# Altium project BTL_IoT.PrjPcb
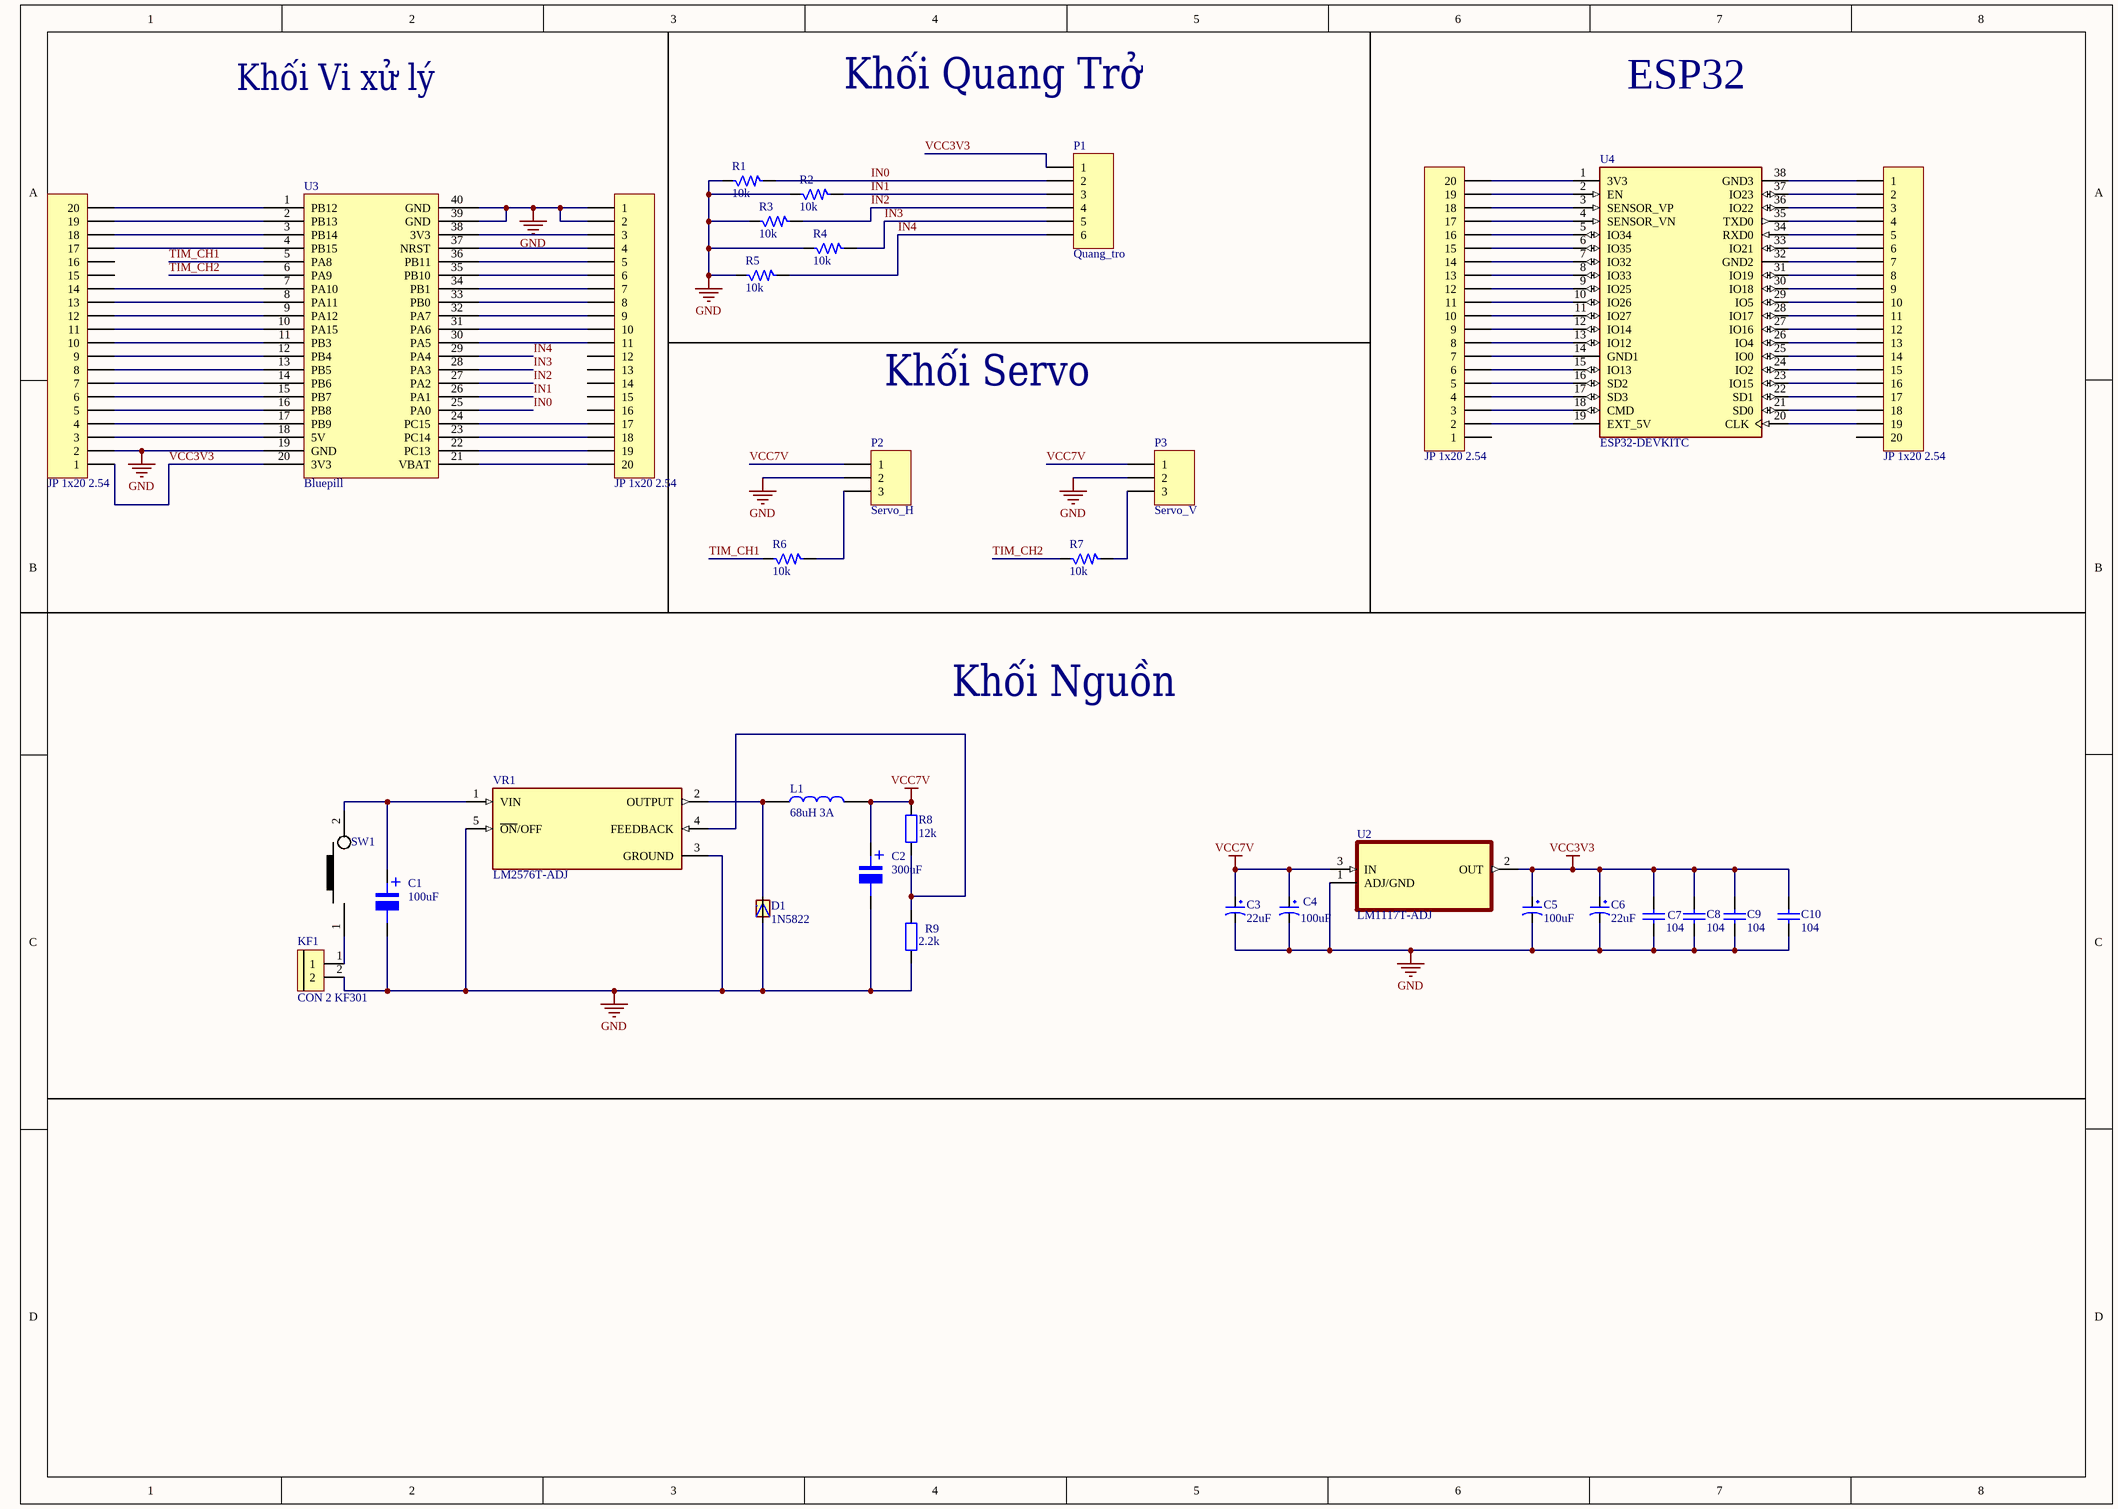
[diagram p0: BTL_IOT_STM32.SchDoc]
1 sheet, 34 parts. Net scope: global (net labels, ports and power ports of the same name join across sheets).
Board file: PCB3.PcbDoc

## Sheet BTL_IOT_STM32.SchDoc
size A3

### Parts
C1  100uF  [CA-ALU-5R]
C2  300uF  [CA-ALU-5R]
C3  22uF  [CA-ALU-5R]
C4  100uF  [CA-ALU-5R]
C5  100uF  [CA-ALU-5R]
C6  22uF  [CA-ALU-5R]
C7  104  [CN1]
C8  104  [CN1]
C9  104  [CN1]
C10  104  [CN1]
D1  1N5822  [DIOAD2120W130L950D530P]
JP1  JP 1x20 2.54  [JP 1x20 CC]
JP2  JP 1x20 2.54  [JP 1x20 CC]
JP3  JP 1x20 2.54  [JP 1x20 CC]
JP4  JP 1x20 2.54  [JP 1x20 CC]
KF1  CON 2 KF301  [Con 2 KF301 5.08]
L1  68uH 3A  [CUON CAM 100uH3A]
P1  Quang_tro  [HDR1X6]
P2  Servo_H  [HDR1X3]
P3  Servo_V  [HDR1X3]
R1  10k  [R1/8W]
R2  10k  [R1/8W]
R3  10k  [R1/8W]
R4  10k  [R1/8W]
R5  10k  [R1/8W]
R6  10k  [R1/8W]
R7  10k  [R1/8W]
R8  12k  [tro vach 1/4w]
R9  2.2k  [tro vach 1/4w]
SW1  SWITCH 10A-2PIN  [SW_2ARS_TH]  (value not drawn)
U2  LM1117T-ADJ  [TO254P470X1016X2222-3P]
U3  Bluepill  [Blue Pill]
U4  ESP32-DEVKITC  [MODULE_ESP32-DEVKITC]
VR1  LM2576T-ADJ  [TO170P1067X483X1651-5]

### Nets
GND: C1.2 C2.2 C3.2 C4.2 C5.2 C6.2 C7.2 C8.2 C9.2 C10.2 D1.A JP3.2 JP4.1 JP4.2 KF1.2 P2.2 P3.2 R1.1 R2.1 R3.1 R4.1 R5.1 R9.1 U2.1(ADJ/GND) U3.19(GND) U3.39(GND) U3.40(GND) VR1.3(GROUND) VR1.5(~{ON}/OFF)
VCC3V3: C5.1 C6.1 C7.1 C8.1 C9.1 C10.1 JP3.1 P1.1 U2.2(OUT) U3.20(3V3)
VCC7V: C2.1 C3.1 C4.1 L1.2 P2.1 P3.1 R8.2 U2.3(IN)
IN0: P1.2 R1.2 U3.25(PA0)
IN1: P1.3 R2.2 U3.26(PA1)
IN2: P1.4 R3.2 U3.27(PA2)
IN3: P1.5 R4.2 U3.28(PA3)
IN4: P1.6 R5.2 U3.29(PA4)
TIM_CH1: R6.1 U3.5(PA8)
TIM_CH2: R7.1 U3.6(PA9)
NetC1_1: C1.1 SW1.2 VR1.1(VIN)
NetD1_C: D1.C L1.1 VR1.2(OUTPUT)
NetJP1_2: JP1.2 U4.19(EXT_5V)
NetJP1_3: JP1.3 U4.18(CMD)
NetJP1_4: JP1.4 U4.17(SD3)
NetJP1_5: JP1.5 U4.16(SD2)
NetJP1_6: JP1.6 U4.15(IO13)
NetJP1_7: JP1.7 U4.14(GND1)
NetJP1_8: JP1.8 U4.13(IO12)
NetJP1_9: JP1.9 U4.12(IO14)
NetJP1_10: JP1.10 U4.11(IO27)
NetJP1_11: JP1.11 U4.10(IO26)
NetJP1_12: JP1.12 U4.9(IO25)
NetJP1_13: JP1.13 U4.8(IO33)
NetJP1_14: JP1.14 U4.7(IO32)
NetJP1_15: JP1.15 U4.6(IO35)
NetJP1_16: JP1.16 U4.5(IO34)
NetJP1_17: JP1.17 U4.4(SENSOR_VN)
NetJP1_18: JP1.18 U4.3(SENSOR_VP)
NetJP1_19: JP1.19 U4.2(EN)
NetJP1_20: JP1.20 U4.1(3V3)
NetJP2_1: JP2.1 U4.38(GND3)
NetJP2_2: JP2.2 U4.37(IO23)
NetJP2_3: JP2.3 U4.36(IO22)
NetJP2_4: JP2.4 U4.35(TXD0)
NetJP2_5: JP2.5 U4.34(RXD0)
NetJP2_6: JP2.6 U4.33(IO21)
NetJP2_7: JP2.7 U4.32(GND2)
NetJP2_8: JP2.8 U4.31(IO19)
NetJP2_9: JP2.9 U4.30(IO18)
NetJP2_10: JP2.10 U4.29(IO5)
NetJP2_11: JP2.11 U4.28(IO17)
NetJP2_12: JP2.12 U4.27(IO16)
NetJP2_13: JP2.13 U4.26(IO4)
NetJP2_14: JP2.14 U4.25(IO0)
NetJP2_15: JP2.15 U4.24(IO2)
NetJP2_16: JP2.16 U4.23(IO15)
NetJP2_17: JP2.17 U4.22(SD1)
NetJP2_18: JP2.18 U4.21(SD0)
NetJP2_19: JP2.19 U4.20(CLK)
NetJP3_3: JP3.3 U3.18(5V)
NetJP3_4: JP3.4 U3.17(PB9)
NetJP3_5: JP3.5 U3.16(PB8)
NetJP3_6: JP3.6 U3.15(PB7)
NetJP3_7: JP3.7 U3.14(PB6)
NetJP3_8: JP3.8 U3.13(PB5)
NetJP3_9: JP3.9 U3.12(PB4)
NetJP3_10: JP3.10 U3.11(PB3)
NetJP3_11: JP3.11 U3.10(PA15)
NetJP3_12: JP3.12 U3.9(PA12)
NetJP3_13: JP3.13 U3.8(PA11)
NetJP3_14: JP3.14 U3.7(PA10)
NetJP3_17: JP3.17 U3.4(PB15)
NetJP3_18: JP3.18 U3.3(PB14)
NetJP3_19: JP3.19 U3.2(PB13)
NetJP3_20: JP3.20 U3.1(PB12)
NetJP4_3: JP4.3 U3.38(3V3)
NetJP4_4: JP4.4 U3.37(NRST)
NetJP4_5: JP4.5 U3.36(PB11)
NetJP4_6: JP4.6 U3.35(PB10)
NetJP4_7: JP4.7 U3.34(PB1)
NetJP4_8: JP4.8 U3.33(PB0)
NetJP4_9: JP4.9 U3.32(PA7)
NetJP4_10: JP4.10 U3.31(PA6)
NetJP4_11: JP4.11 U3.30(PA5)
NetJP4_17: JP4.17 U3.24(PC15)
NetJP4_18: JP4.18 U3.23(PC14)
NetJP4_19: JP4.19 U3.22(PC13)
NetJP4_20: JP4.20 U3.21(VBAT)
NetKF1_1: KF1.1 SW1.1
NetP2_3: P2.3 R6.2
NetP3_3: P3.3 R7.2
NetR8_1: R8.1 R9.2 VR1.4(FEEDBACK)

Not connected (* = marked no-connect by the designer): JP1 1; JP2 20; JP3 15 16; JP4 12 13 14 15 16

### Notes on the sheet
- Khối Vi xử lý
- Khối Quang Trở
- ESP32
- Khối Servo
- Khối Nguồn
- (in symbol Tu Nhom 100uF 16V) +

### Library data of the parts
C1 C2 = Tu Nhom 100uF 16V: Dán; Don_Vi: Con; So_Chan: 2; Ten_Linh_Kien: Tụ Nhôm 100uF 16V 6.3x5.4MM; Ma_Hang: MH002219; Chung_Loai: Dán; Kieu_Chan: *
C3 C6 = Tu tantalum 22uF 25V SMD6032: Dán; Don_Vi: Con; So_Chan: 2; Ten_Linh_Kien: Tụ tantalum 226E-22uF 25V SMD6032; Ma_Hang: MH002651; Chung_Loai: Dán; Kieu_Chan: *
C4 C5 = Tu tantalum 100uF 10V SMD6032: Dán; Don_Vi: Con; So_Chan: 2; Ten_Linh_Kien: Tụ tantalum 107A-100uF 10V SMD6032; Ma_Hang: MH007594; Chung_Loai: Dán; Kieu_Chan: *
C7-C10 = Tu 0603 104 50V 10%: Dán; Don_Vi: Con; So_Chan: 2; Ten_Linh_Kien: Tụ 0603 104-100nF 10% 50V; Ma_Hang: MH004568; Chung_Loai: Dán; Kieu_Chan: *
D1 = 1N5822: Diode Schottky 40 V 3A Through Hole DO-201AD; MF: STMicroelectronics; Value: *; SnapEDA_Link: https://www.snapeda.com/parts/1N5822/STMicroelectronics/view-part/?ref=snap; Purchase-URL: https://pricing.snapeda.com/search/part/1N5822/?ref=eda; Availability: In Stock; Price: None; Package: DO-201 STMicroelectronics; Check_prices: https://www.snapeda.com/parts/1N5822/STMicroelectronics/view-part/?ref=eda; MP: 1N5822
JP1-JP4 = JP 1x20 2.54 Cai Cong: Cắm; Ten_Linh_Kien: Jump Đơn Cái 2.54MM 1x40P Cong; Don_Vi: Con; Ma_Hang: MH001265; Ghi_Chu: *; Kieu_Chan: *; Chung_Loai: Cắm
KF1 = CON 2 KF301: Cắm; Ma_Hang: MH000987; Ten_Linh_Kien: CON 2 KF301-2P 5.08MM Xanh Dương; Chung_Loai: Cắm; Ghi_Chu: *; Kieu_Chan: *; Don_Vi: Con
L1 = CUON CAM 100uH DIP: Dán; Don_Vi: Con; Ma_Hang: MH002209; Ten_Linh_Kien: Cuộn Cảm 100uH 3A 8x10MM; Chung_Loai: Dán; Ghi Chu: *; Kieu Chan: *
P1 = Header 6: Header, 6-Pin; LatestRevisionDate: 17-Jul-2002; LatestRevisionNote: Re-released for DXP Platform.; Publisher: Altium Limited
P2 P3 = Header 3: Header, 3-Pin; LatestRevisionDate: 17-Jul-2002; LatestRevisionNote: Re-released for DXP Platform.; Publisher: Altium Limited
R1-R7 = R: Resistor 1/4W; Value: R1/4W - 1K
R8 = Tro Vach 1/4W 5% 12k: Cắm; Don_Vi: Con; So_Chan: 2; Ma_Hang: MH007389; Ten_Linh_Kien: Trở Vạch 1/4w 5% 12k; Chung_Loai: Cắm; Kieu_Chan: *
R9 = Tro Vach 1/4W 5% 2.2k: Cắm; Don_Vi: Con; So_Chan: 2; Ten_Linh_Kien: Trở Vạch 1/4w 5% 2.2k; Ma_Hang: MH007293; Chung_Loai: Cắm; Kieu_Chan: *
SW1 = SW1_RS-471005264153-TH: Rocker Switch SPST 16A (AC), 10A (DC) 250V Panel Mount, Snap-In; Manufacturer: Würth Elektronik; Alternate Part Number-1: NA; Manufacturer Part Number: 471005264153; Case/Package: TH; Supplier-1: Würth Elektronik; Supplier Part Number-1: 471005264153
U2 = LM1117T-ADJ: Linear Voltage Regulator IC 1 Output 800mA TO-220-3; MP: LM1117TADJ; MF: Texas Instruments; SnapEDA_Link: https://www.snapeda.com/parts/LM1117TADJ/Texas%20Instruments/view-part/20524/?ref=snap; Value: *; Price: None; Package: TO-220 National Semiconductor; Availability: Unavailable
U3 = STM32F103C8T6
U4 = ESP32-DEVKITC: ESP32-WROOM-32UE series Transceiver; 802.11 b/g/n (Wi-Fi, WiFi, WLAN), Bluetooth Â® Smart Ready 4.x Dual Mode Evaluation Board; MF: Espressif Systems; Value: *; SnapEDA_Link: https://www.snapeda.com/parts/ESP32-DEVKITC/Espressif+Systems/view-part/?ref=snap; MP: ESP32-DEVKITC; Purchase-URL: https://pricing.snapeda.com/search/part/ESP32-DEVKITC/?ref=eda; Check_prices: https://www.snapeda.com/parts/ESP32-DEVKITC/Espressif+Systems/view-part/?ref=eda; Availability: In Stock; Price: None; Package: None
VR1 = LM2576T-ADJ: SIMPLE SWITCHER&reg; 40V, 3A Low Component Count Step-Down Regulator 5-TO-220 -40 to 125; MF: Texas Instruments; Availability: In Stock; SnapEDA_Link: https://www.snapeda.com/parts/LM2576T-ADJ/Texas+Instruments/view-part/?ref=snap; Price: None; MP: LM2576T-ADJ; Package: TO-220-5 Texas Instruments; Value: *; Purchase-URL: https://pricing.snapeda.com/search/part/LM2576T-ADJ/?ref=eda; Check_prices: https://www.snapeda.com/parts/LM2576T-ADJ/Texas+Instruments/view-part/?ref=eda